# EAGLE schematic rpi_to_ads1299 (EAGLE 9.7.0)
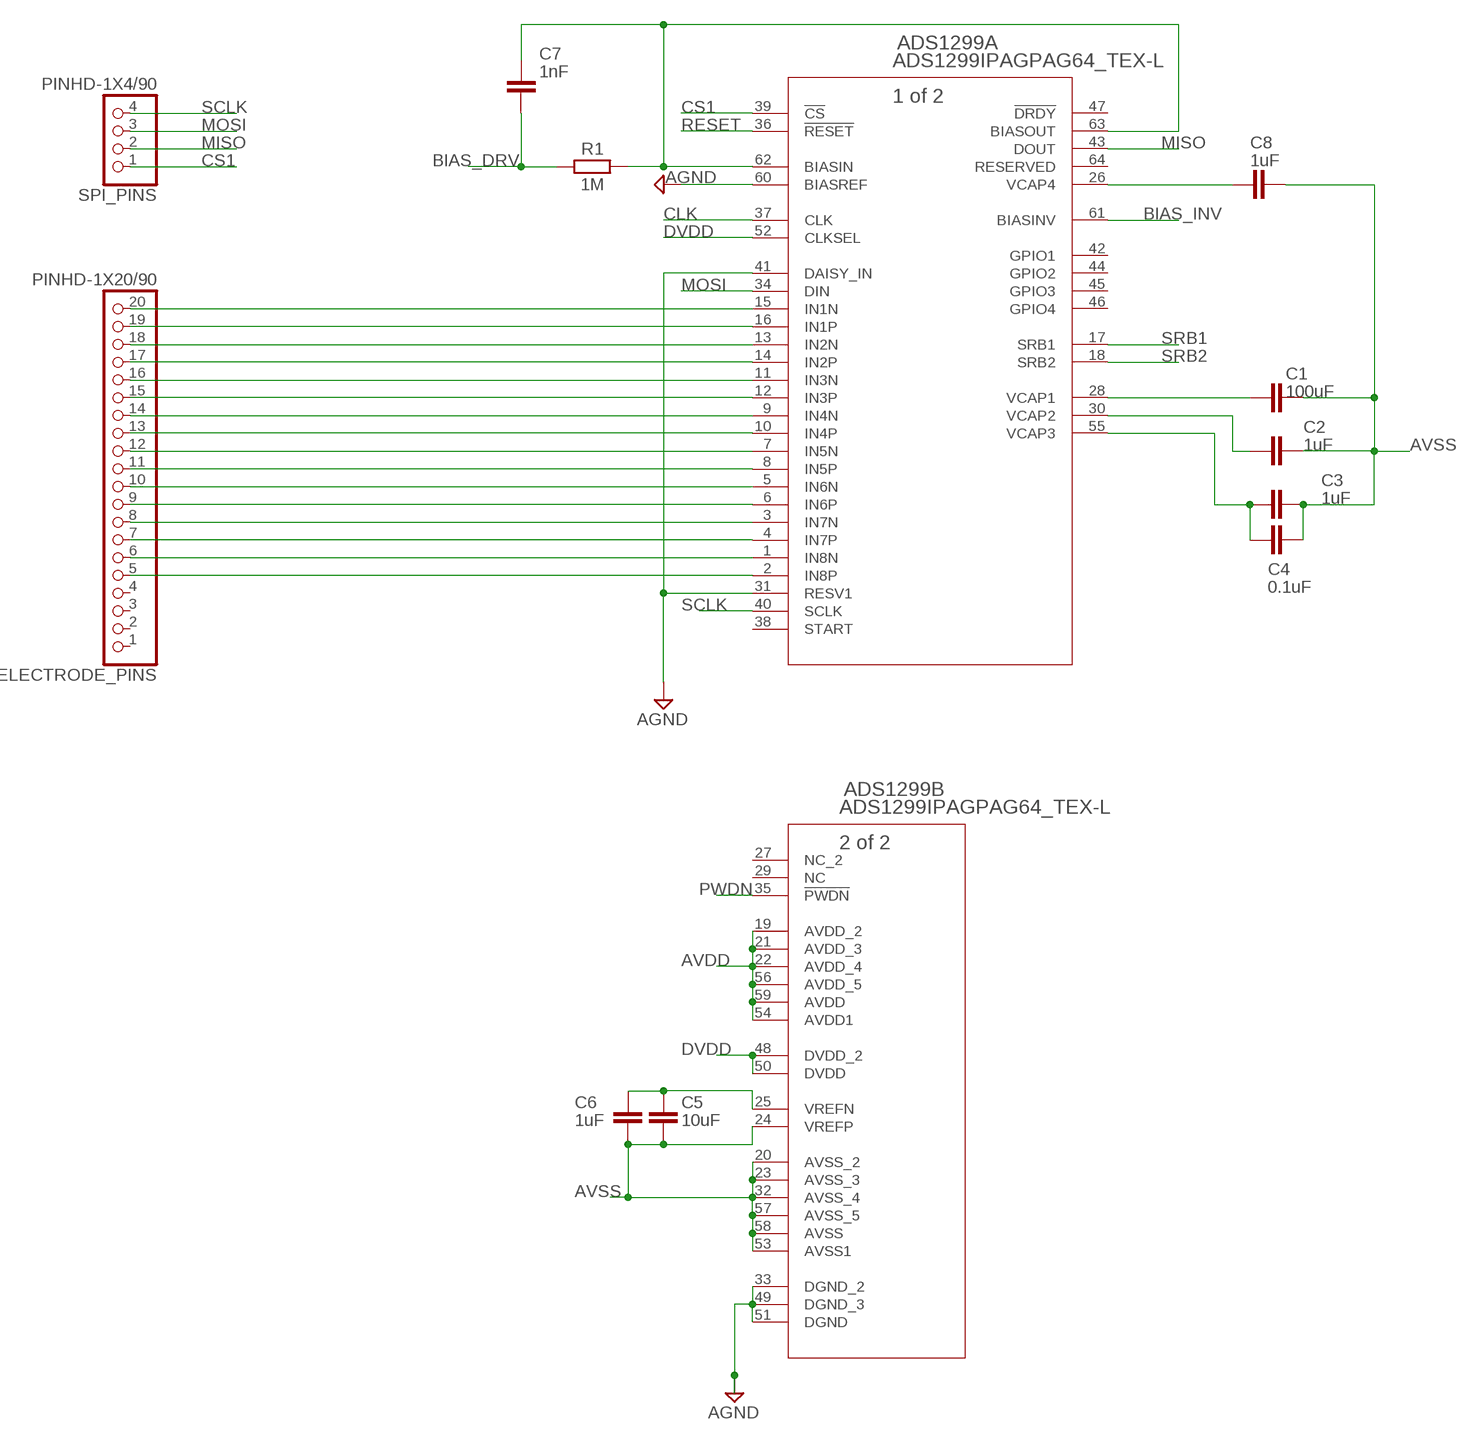
[diagram p0: schematic, sheet 1]

## Parts
ADS1299  ADS1299IPAGPAG64_TEX-L  [PAG64_TEX-L]
C1  100uF  C_CHIP-0402(1005-METRIC)  [CAPC1005X60]
C2  1uF  C_CHIP-0402(1005-METRIC)  [CAPC1005X60]
C3  1uF  C_CHIP-0402(1005-METRIC)  [CAPC1005X60]
C4  0.1uF  C_CHIP-0402(1005-METRIC)  [CAPC1005X60]
C5  10uF  C_CHIP-0402(1005-METRIC)  [CAPC1005X60]
C6  1uF  C_CHIP-0402(1005-METRIC)  [CAPC1005X60]
C7  1nF  C_CHIP-0402(1005-METRIC)  [CAPC1005X60]
C8  1uF  C_CHIP-0402(1005-METRIC)  [CAPC1005X60]
ELECTRODE_PINS  PINHD-1X20/90  [1X20/90]
R1  1M  R_CHIP-0402(1005-METRIC)  [RESC1005X40]
SPI_PINS  PINHD-1X4/90  [1X04/90]

## Nets
AGND: ADS1299.31(A:RESV1) ADS1299.33(B:DGND_2) ADS1299.41(A:DAISY_IN) ADS1299.49(B:DGND_3) ADS1299.51(B:DGND) ADS1299.60(A:BIASREF)
AVDD: ADS1299.19(B:AVDD_2) ADS1299.21(B:AVDD_3) ADS1299.22(B:AVDD_4) ADS1299.54(B:AVDD1) ADS1299.56(B:AVDD_5) ADS1299.59(B:AVDD)
AVSS: ADS1299.20(B:AVSS_2) ADS1299.23(B:AVSS_3) ADS1299.24(B:VREFP) ADS1299.32(B:AVSS_4) ADS1299.53(B:AVSS1) ADS1299.57(B:AVSS_5) ADS1299.58(B:AVSS) C1.1 C2.1 C3.1 C4.1 C5.2 C6.2 C8.2
BIAS_DRV: C7.2 R1.1
BIAS_INV: ADS1299.61(A:BIASINV)
CLK: ADS1299.37(A:CLK)
CS1: ADS1299.39(A:!CS) SPI_PINS.1
DVDD: ADS1299.48(B:DVDD_2) ADS1299.50(B:DVDD) ADS1299.52(A:CLKSEL)
MISO: ADS1299.43(A:DOUT) SPI_PINS.2
MOSI: ADS1299.34(A:DIN) SPI_PINS.3
N$1: ADS1299.62(A:BIASIN) ADS1299.63(A:BIASOUT) C7.1 R1.2
N$2: ADS1299.15(A:IN1N) ELECTRODE_PINS.20
N$3: ADS1299.16(A:IN1P) ELECTRODE_PINS.19
N$4: ADS1299.13(A:IN2N) ELECTRODE_PINS.18
N$5: ADS1299.14(A:IN2P) ELECTRODE_PINS.17
N$6: ADS1299.11(A:IN3N) ELECTRODE_PINS.16
N$7: ADS1299.12(A:IN3P) ELECTRODE_PINS.15
N$8: ADS1299.9(A:IN4N) ELECTRODE_PINS.14
N$9: ADS1299.10(A:IN4P) ELECTRODE_PINS.13
N$10: ADS1299.7(A:IN5N) ELECTRODE_PINS.12
N$11: ADS1299.8(A:IN5P) ELECTRODE_PINS.11
N$12: ADS1299.5(A:IN6N) ELECTRODE_PINS.10
N$13: ADS1299.6(A:IN6P) ELECTRODE_PINS.9
N$14: ADS1299.3(A:IN7N) ELECTRODE_PINS.8
N$15: ADS1299.4(A:IN7P) ELECTRODE_PINS.7
N$16: ADS1299.1(A:IN8N) ELECTRODE_PINS.6
N$17: ADS1299.2(A:IN8P) ELECTRODE_PINS.5
N$18: ADS1299.25(B:VREFN) C5.1 C6.1
N$19: ADS1299.26(A:VCAP4) C8.1
N$22: ADS1299.28(A:VCAP1) C1.2
N$23: ADS1299.30(A:VCAP2) C2.2
N$24: ADS1299.55(A:VCAP3) C3.2 C4.2
PWDN: ADS1299.35(B:!PWDN)
RESET: ADS1299.36(A:!RESET)
SCLK: ADS1299.40(A:SCLK) SPI_PINS.4
SRB1: ADS1299.17(A:SRB1)
SRB2: ADS1299.18(A:SRB2)
Unconnected: ADS1299.27(B:NC_2) ADS1299.29(B:NC) ADS1299.38(A:START) ADS1299.42(A:GPIO1) ADS1299.44(A:GPIO2) ADS1299.45(A:GPIO3) ADS1299.46(A:GPIO4) ADS1299.47(A:!DRDY) ADS1299.64(A:RESERVED) ELECTRODE_PINS.1 ELECTRODE_PINS.2 ELECTRODE_PINS.3 ELECTRODE_PINS.4

## Library data of the parts
ADS1299 = 2023-07-11_19-04-34_Library:ADS1299IPAG; COPYRIGHT: Copyright (C) 2023 Ultra Librarian. All rights reserved.; MANUFACTURER_PART_NUMBER: ADS1299IPAG; MFR_NAME: Texas Instruments
C1-C6 = Tutorial - Fusion 360:C: Capacitor - Generic; CATEGORY: Capacitor
C7 C8 = Capacitor:C: Capacitor - Generic; CATEGORY: Capacitor
ELECTRODE_PINS = Connector:PINHD-1X20: PIN HEADER; CATEGORY: CONNECTOR; SUB-CATEGORY: PIN-HEADER
R1 = Resistor:R: Resistor Fixed - Generic; CATEGORY: Resistor; SUB-CATEGORY: Fixed
SPI_PINS = Connector:PINHD-1X4: PIN HEADER; CATEGORY: CONNECTOR; SUB-CATEGORY: PIN-HEADER